# Altium schematic sheet LED8.SchDoc
size Letter; CompanyName: Brinton Engineering, LLC; Address1: 3479 Edison Way; Address2: Menlo Park CA 94025; Address3: +1 (877) 778-8435; Address4: brintonengineering.com; Revision: 1; SheetNumber: 26; SheetTotal: 41
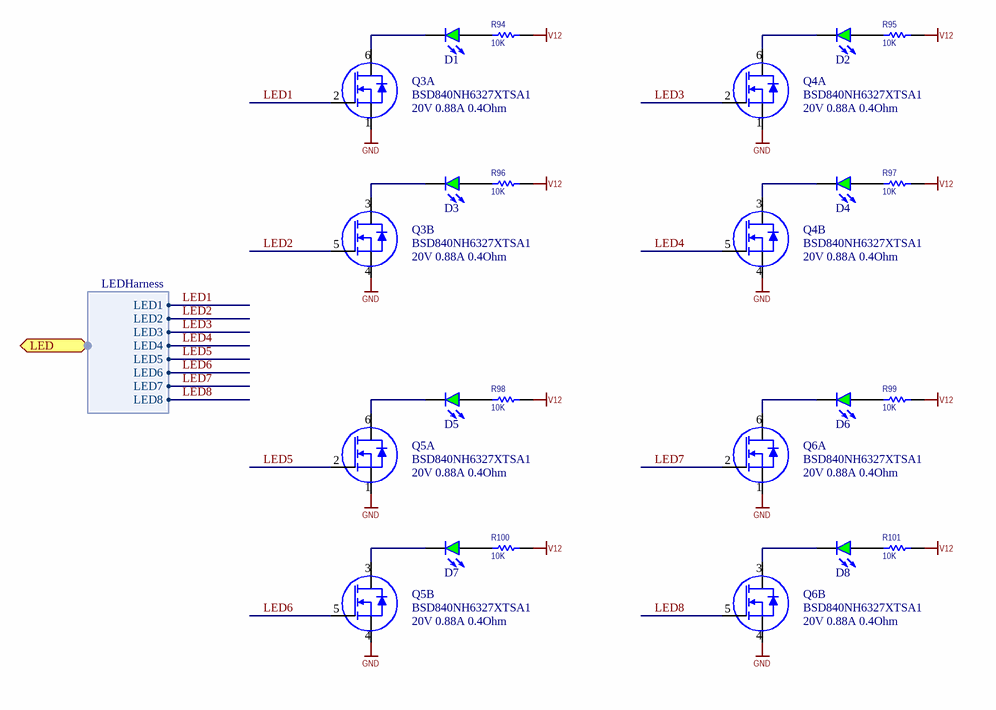
[diagram p0: LED8.SchDoc]

## Parts
D1  LED Green 130° 0603  [CAPC1608N-0603]  (value not drawn)
D2  LED Green 130° 0603  [CAPC1608N-0603]  (value not drawn)
D3  LED Green 130° 0603  [CAPC1608N-0603]  (value not drawn)
D4  LED Green 130° 0603  [CAPC1608N-0603]  (value not drawn)
D5  LED Green 130° 0603  [CAPC1608N-0603]  (value not drawn)
D6  LED Green 130° 0603  [CAPC1608N-0603]  (value not drawn)
D7  LED Green 130° 0603  [CAPC1608N-0603]  (value not drawn)
D8  LED Green 130° 0603  [CAPC1608N-0603]  (value not drawn)
Q3  value 20V 0.88A 0.4Ohm  [SOT-363]  (hidden comment: Tran N-MOSFET 20V 0.88A Dual Logic Level SOT363)  (parts A,B of 2)
Q4  value 20V 0.88A 0.4Ohm  [SOT-363]  (hidden comment: Tran N-MOSFET 20V 0.88A Dual Logic Level SOT363)  (parts A,B of 2)
Q5  value 20V 0.88A 0.4Ohm  [SOT-363]  (hidden comment: Tran N-MOSFET 20V 0.88A Dual Logic Level SOT363)  (parts A,B of 2)
Q6  value 20V 0.88A 0.4Ohm  [SOT-363]  (hidden comment: Tran N-MOSFET 20V 0.88A Dual Logic Level SOT363)  (parts A,B of 2)
R94  value 10K  [0402]  (hidden comment: RES 0402)
R95  value 10K  [0402]  (hidden comment: RES 0402)
R96  value 10K  [0402]  (hidden comment: RES 0402)
R97  value 10K  [0402]  (hidden comment: RES 0402)
R98  value 10K  [0402]  (hidden comment: RES 0402)
R99  value 10K  [0402]  (hidden comment: RES 0402)
R100  value 10K  [0402]  (hidden comment: RES 0402)
R101  value 10K  [0402]  (hidden comment: RES 0402)

## Ports
LED (harness LEDHarness)

## Harnesses
LEDHarness: LED1, LED2, LED3, LED4, LED5, LED6, LED7, LED8

## Nets
GND: Q3.1(Source_1) Q3.4(Source_2) Q4.1(Source_1) Q4.4(Source_2) Q5.1(Source_1) Q5.4(Source_2) Q6.1(Source_1) Q6.4(Source_2)
V12: R94.2 R95.2 R96.2 R97.2 R98.2 R99.2 R100.2 R101.2
LED1: Q3.2(Gate_1) ; port LED.LED1
LED2: Q3.5(Gate_2) ; port LED.LED2
LED3: Q4.2(Gate_1) ; port LED.LED3
LED4: Q4.5(Gate_2) ; port LED.LED4
LED5: Q5.2(Gate_1) ; port LED.LED5
LED6: Q5.5(Gate_2) ; port LED.LED6
LED7: Q6.2(Gate_1) ; port LED.LED7
LED8: Q6.5(Gate_2) ; port LED.LED8
NetD1_1: D1.1(Cathode) Q3.6(Drain_1)
NetD1_2: D1.2(Anode) R94.1
NetD2_1: D2.1(Cathode) Q4.6(Drain_1)
NetD2_2: D2.2(Anode) R95.1
NetD3_1: D3.1(Cathode) Q3.3(Drain_2)
NetD3_2: D3.2(Anode) R96.1
NetD4_1: D4.1(Cathode) Q4.3(Drain_2)
NetD4_2: D4.2(Anode) R97.1
NetD5_1: D5.1(Cathode) Q5.6(Drain_1)
NetD5_2: D5.2(Anode) R98.1
NetD6_1: D6.1(Cathode) Q6.6(Drain_1)
NetD6_2: D6.2(Anode) R99.1
NetD7_1: D7.1(Cathode) Q5.3(Drain_2)
NetD7_2: D7.2(Anode) R100.1
NetD8_1: D8.1(Cathode) Q6.3(Drain_2)
NetD8_2: D8.2(Anode) R101.1

## Notes on the sheet
- Title
- Engineer
- Revision
- Drawn By
- Checked By
- Date
- Sheet
- of

## Library data of the parts
D1-D8 = LTST-C191KGKT: Dist: Digi-Key; Dist P/N: 160-1446-1-ND; Mfg: Liteon; Price: 0.39; HelpURL: http://optoelectronics.liteon.com/upload/download/DS22-2000-228/S_110_LTST-C191KGKT.pdf; Mfgr P/N: LTST-C191KGKT; Value: LTST-C191KGKT
Q3-Q6 = BSD840NH6327XTSA1: Dist: Digi-Key; Dist P/N: BSD840NH6327XTSA1CT-ND; Mfg: Infineon; Price: 0.33; HelpURL: http://www.infineon.com/dgdl/BSD840N_Rev2.3_.pdf?folderId=db3a3043156fd573011622e10b5c1f67&fileId=db3a30431b0626df011b12b4486c7c02; Mfgr P/N: BSD840NH6327XTSA1
R94-R101 = RES 0402: Resistor, SMD 0402; PCB Package: 0402; Manufacturer: *; Manufacturer P/N: *